# Altium schematic sheet TEMPERATURE_SENSOR.SchDoc
size 420 x 297 mm; SheetNumber: 3; SheetTotal: 19
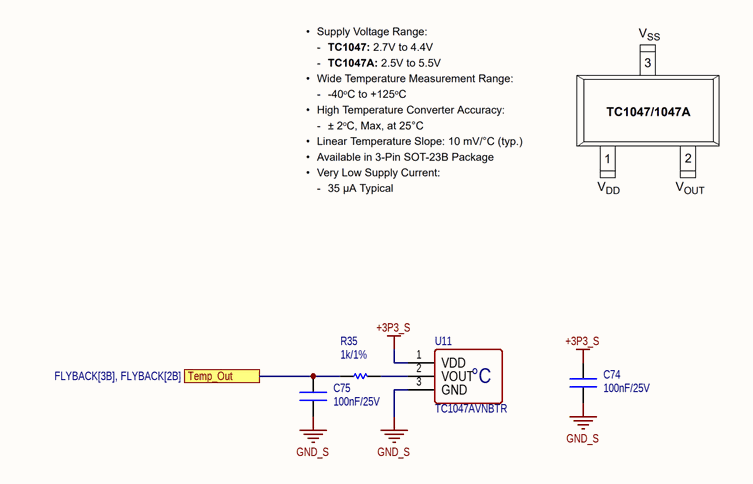
[diagram p0: TEMPERATURE_SENSOR.SchDoc]

## Parts
C74  100nF/25V  [CN-SMD-0603]
C75  100nF/25V  [CN-SMD-0603]
R35  1k/1%  [RES-SMD-0603]
U11  TC1047AVNBTR  [SOT23-132]

## Ports
Temp_Out (see FLYBACK[3B], FLYBACK[2B])

## Nets
+3P3_S: C74.2 U11.1(VDD)
GND_S: C74.1 C75.1 U11.3(GND)
Temp_Out: C75.2 R35.1 ; port Temp_Out
NetR35_2: R35.2 U11.2(VOUT)

## Notes on the sheet
- Project:
- Sub-system:
- Design by:
- Sheet title:
- Sheet
- of
- Checked by:
- Approved by:
- Document No:
- Revision:
- Size:
- Date:
- (in symbol TC1047AVNBTR) °C

## Library data of the parts
C74 C75 = CN: CAP CER 0.1UF 25V X7R 0603; PN: CL10B104KA8NNNC
R35 = Res-SMD: RES SMD 1K OHM 1% 1/10W 0603; Manufacturer: Generic Components; PN: ERJ-3EKF1001V; Class: Passive; Publisher: Altium Hobart Technology Centre
U11 = TC1047AVNBTR: SENSOR ANALOG -40C-125C SOT23-3; PN: TC1047AVNBTR